# Altium schematic sheet SOM.SchDoc
size A3; SheetNumber: 1; SheetTotal: 1; PageSetup: Record=PageOptions|CenterHorizontal=True|CenterVertical=True|PrintScale=0.97|XCorrection=1.00|YCorrection=1.00|PrintKind=1|BorderSize=5000000|LeftOffset=0|BottomOffset=0|Orientation=2|PaperLength=2970|PaperWidth=2100|Scale=100|PaperSource=7|PrintQuality=600|MediaType=1|DitherType=10|PaperKind=A4|PrintScaleMode=1
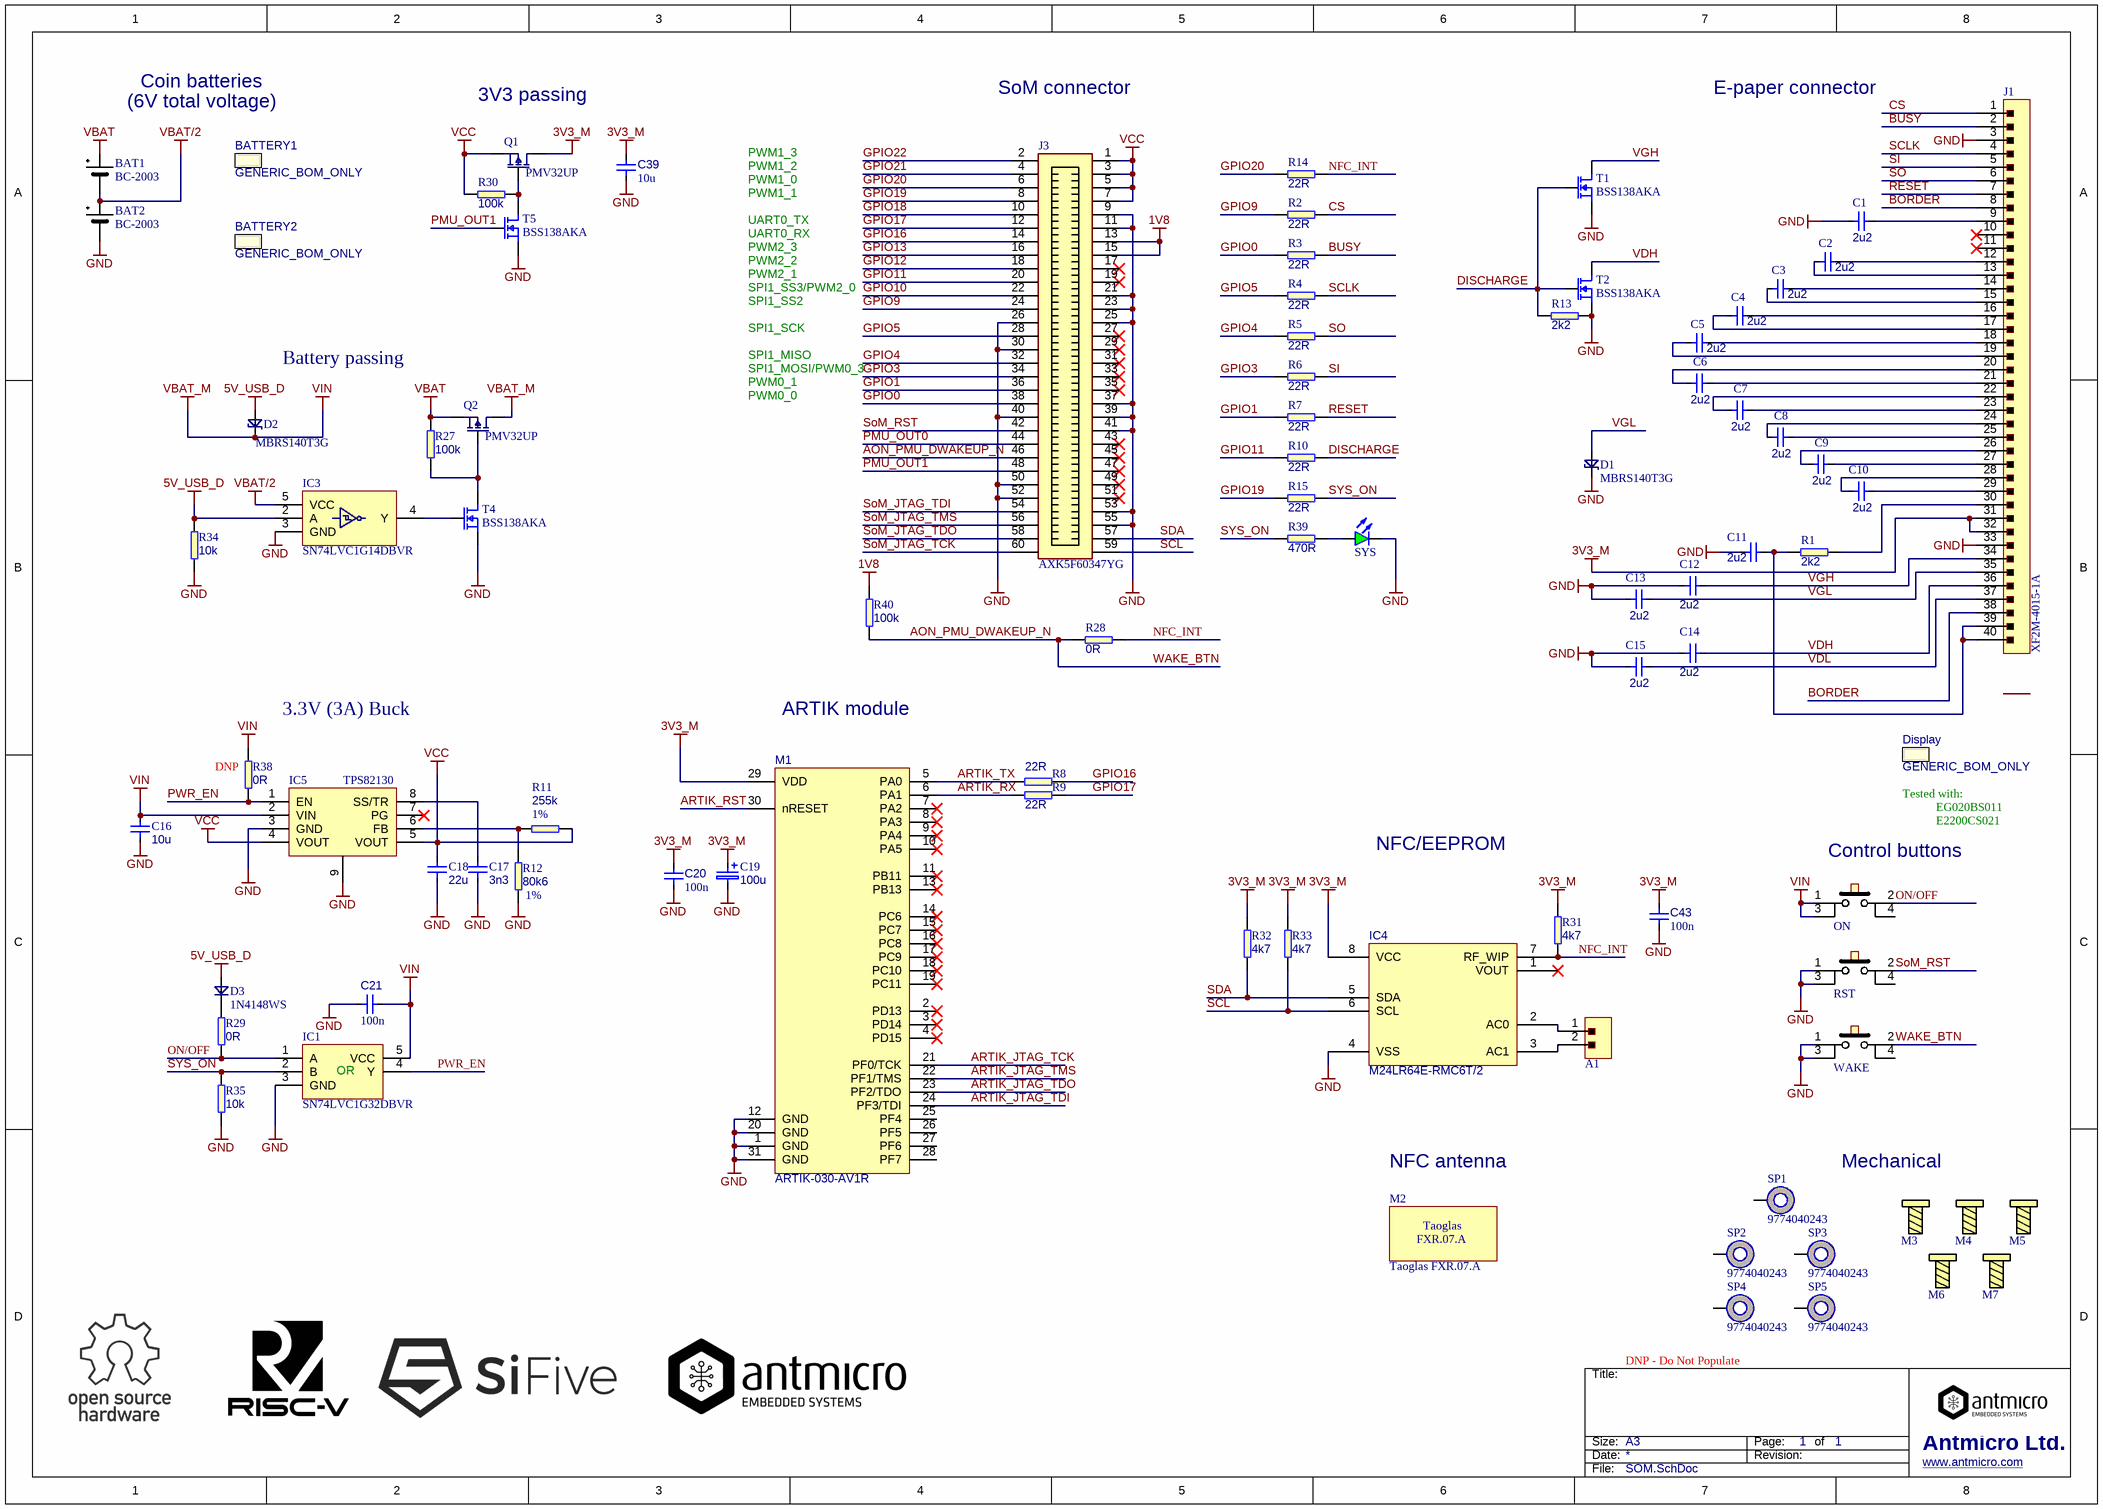
[diagram p0: SOM.SchDoc]

## Parts
A1  811-22-002-30-001101  [812-22-002-30-003101]  (value not drawn)
BAT1  BC-2003  [BC-2003]
BAT2  BC-2003  [BC-2003]
BATTERY1  GENERIC_BOM_ONLY  (mechanical)
BATTERY2  GENERIC_BOM_ONLY  (mechanical)
C1  2u2  [0402]
C2  2u2  [0603]
C3  2u2  [0603]
C4  2u2  [0603]
C5  2u2  [0603]
C6  2u2  [0603]
C7  2u2  [0603]
C8  2u2  [0603]
C9  2u2  [0603]
C10  2u2  [0603]
C11  2u2  [0402]
C12  2u2  [0603]
C13  2u2  [0603]
C14  2u2  [0603]
C15  2u2  [0603]
C16  10u  [0805]
C17  3n3  [0603]
C18  22u  [0805]
C19  100u  [KEMET_A]
C20  100n  [0603]
C21  100n  [0402]
C39  10u  [0402]
C43  100n  [0402]
D1  MBRS140T3G  [SMB]
D2  MBRS140T3G  [SMB]
D3  1N4148WS  [SOD-323]
Display  GENERIC_BOM_ONLY  (mechanical)
IC1  SN74LVC1G32DBVR  [SOT23-5]
IC3  SN74LVC1G14DBVR  [SOT23-5]
IC4  M24LR64E-RMC6T/2  [UFDFPN-8]
IC5  TPS82130  [MicroSIP]
J1  XF2M-4015-1A  [XF2M-4015-1A]
J3  AXK5F60347YG  [AXK5F60347YG]
M1  ARTIK-030-AV1R  [ARTIK-030]
M2  Taoglas FXR.07.A  (mechanical)
M3  M2x5  (value not drawn)  (mechanical)
M4  M2x5  (value not drawn)  (mechanical)
M5  M2x5  (value not drawn)  (mechanical)
M6  M2x5  (value not drawn)  (mechanical)
M7  M2x5  (value not drawn)  (mechanical)
ON  434333045822  [434333045822]  (value not drawn)
Q1  PMV32UP  [SOT-23]
Q2  PMV32UP  [SOT-23]
R1  2k2  [0402]
R2  22R  [0402]
R3  22R  [0402]
R4  22R  [0402]
R5  22R  [0402]
R6  22R  [0402]
R7  22R  [0402]
R8  22R  [0603]
R9  22R  [0603]
R10  22R  [0402]
R11  Tolerance: 1%  [0402]  (hidden comment: 255k)
R12  Tolerance: 1%  [0402]  (hidden comment: 80k6)
R13  2k2  [0402]
R14  22R  [0402]
R15  22R  [0402]
R27  100k  [0402]
R28  0R  [0402]
R29  0R  [0402]
R30  100k  [0402]
R31  4k7  [0402]
R32  4k7  [0402]
R33  4k7  [0402]
R34  10k  [0402]
R35  10k  [0402]
R38  0R  [0402]
R39  470R  [0603]
R40  100k  [0402]
RST  434333045822  [434333045822]  (value not drawn)
SP1  9774040243  [M2-1mm]  (mechanical)
SP2  9774040243  [M2-4mm]  (mechanical)
SP3  9774040243  [M2-4mm]  (mechanical)
SP4  9774040243  [M2-4mm]  (mechanical)
SP5  9774040243  [M2-4mm]  (mechanical)
SYS  KPT-1608SGC  [LED0603]  (value not drawn)
T1  BSS138AKA  [SOT-23]
T2  BSS138AKA  [SOT-23]
T4  BSS138AKA  [SOT-23]
T5  BSS138AKA  [SOT-23]
WAKE  434333045822  [434333045822]  (value not drawn)

## Nets
1V8: J3.13 J3.15 R40.2
3V3_M: C19.1 C20.2 C39.2 C43.1 IC4.8(VCC) J1.31 J1.32 M1.29(VDD) Q1.3(D) R31.2 R32.2 R33.2
5V_USB_D: D2.A D3.A IC3.2(A) R34.2
GND: BAT2.- C1.1 C11.1 C12.1 C13.1 C14.1 C15.1 C16.1 C17.1 C18.1 C19.2 C20.1 C21.1 C39.1 C43.2 D1.C IC1.3(GND) IC3.3(GND) IC4.4(VSS) IC5.3(GND) IC5.9(GND) J1.3 J1.33 J3.9 J3.11 J3.21 J3.23 J3.25 J3.26 J3.30 J3.37 J3.39 J3.40 J3.41 J3.50 J3.52 J3.53 J3.55 M1.1(GND) M1.12(GND) M1.20(GND) M1.31(GND) R12.2 R13.2 R34.1 R35.1 RST.1 RST.3 SYS.K T1.2(S) T2.2(S) T4.2(S) T5.2(S) WAKE.1 WAKE.3
VBAT: BAT1.+ Q2.2(S) R27.2
VBAT/2: BAT1.- BAT2.+ IC3.5(VCC)
VBAT_M: C16.2 C21.2 D2.C IC1.5(VCC) IC5.2(VIN) ON.1 ON.3 Q2.3(D) R38.2  [also labelled VIN]
VCC: C18.2 IC5.4(VOUT) IC5.5(VOUT) J3.1 J3.3 J3.5 J3.7 Q1.2(S) R11.2 R30.1
AON_PMU_DWAKEUP_N: J3.46 R28.1 R40.1 WAKE.2  [also labelled WAKE_BTN]
ARTIK_JTAG_TCK: M1.21(PF0/TCK)
ARTIK_JTAG_TDI: M1.24(PF3/TDI)
ARTIK_JTAG_TDO: M1.23(PF2/TDO)
ARTIK_JTAG_TMS: M1.22(PF1/TMS)
ARTIK_RST: M1.30(nRESET)
ARTIK_RX: M1.6(PA1) R9.1
ARTIK_TX: M1.5(PA0) R8.1
BORDER: J1.8 J1.38
BUSY: J1.2 R3.2
CS: J1.1 R2.2
DISCHARGE: R10.2 R13.1 T1.1(G) T2.1(G)
GPIO0: J3.38 R3.1
GPIO1: J3.36 R7.1
GPIO3: J3.34 R6.1
GPIO4: J3.32 R5.1
GPIO5: J3.28 R4.1
GPIO9: J3.24 R2.1
GPIO10: J3.22
GPIO11: J3.20 R10.1
GPIO12: J3.18
GPIO13: J3.16
GPIO16: J3.14 R8.2
GPIO17: J3.12 R9.2
GPIO18: J3.10
GPIO19: J3.8 R15.1
GPIO20: J3.6 R14.1
GPIO21: J3.4
GPIO22: J3.2
NFC_INT: IC4.7(RF_WIP) R14.2 R28.2 R31.1
ON/OFF: IC1.1(A) ON.2 R29.1
PMU_OUT0: J3.44
PMU_OUT1: J3.48 T5.1(G)
PWR_EN: IC1.4(Y) IC5.1(EN) R38.1
RESET: J1.7 R7.2
SCL: IC4.6(SCL) J3.59 R33.1
SCLK: J1.4 R4.2
SDA: IC4.5(SDA) J3.57 R32.1
SI: J1.5 R6.2
SO: J1.6 R5.2
SoM_JTAG_TCK: J3.60
SoM_JTAG_TDI: J3.54
SoM_JTAG_TDO: J3.58
SoM_JTAG_TMS: J3.56
SoM_RST: J3.42 RST.2
SYS_ON: IC1.2(B) R15.2 R35.2 R39.2
VDH: C14.2 J1.36 T2.3(D)
VDL: C15.2 J1.37
VGH: C12.2 J1.34 T1.3(D)
VGL: C13.2 D1.A J1.35
NetA1_1: A1.1 IC4.2(AC0)
NetA1_2: A1.2 IC4.3(AC1)
NetC1_2: C1.2 J1.9
NetC2_1: C2.1 J1.13
NetC2_2: C2.2 J1.12
NetC3_1: C3.1 J1.15
NetC3_2: C3.2 J1.14
NetC4_1: C4.1 J1.17
NetC4_2: C4.2 J1.16
NetC5_1: C5.1 J1.19
NetC5_2: C5.2 J1.18
NetC6_1: C6.1 J1.20
NetC6_2: C6.2 J1.21
NetC7_1: C7.1 J1.22
NetC7_2: C7.2 J1.23
NetC8_1: C8.1 J1.24
NetC8_2: C8.2 J1.25
NetC9_1: C9.1 J1.26
NetC9_2: C9.2 J1.27
NetC10_1: C10.1 J1.28
NetC10_2: C10.2 J1.29
NetC11_2: C11.2 J1.39 J1.40 R1.1
NetC17_2: C17.2 IC5.8(SS/TR)
NetD3_C: D3.C R29.2
NetIC3_4: IC3.4(Y) T4.1(G)
NetIC5_6: IC5.6(FB) R11.1 R12.1
NetJ1_30: J1.30 R1.2
NetQ1_1: Q1.1(G) R30.2 T5.3(D)
NetQ2_1: Q2.1(G) R27.1 T4.3(D)
NetR39_1: R39.1 SYS.A

Not connected (* = marked no-connect by the designer): IC4 1(VOUT)*; IC5 7(PG)*; J1 10* 11*; J3 17* 19* 27* 29* 31* 33* 35* 43* 45* 47* 49* 51*; M1 2(PD13)* 3(PD14)* 4(PD15)* 7(PA2)* 8(PA3)* 9(PA4)* 10(PA5)* 11(PB11)* 13(PB13)* 14(PC6)* 15(PC7)* 16(PC8)* 17(PC9)* 18(PC10)* 19(PC11)* 25(PF4) 26(PF5) 27(PF6) 28(PF7); ON 4; RST 4; SP1 1; SP2 1; SP3 1; SP4 1; SP5 1; WAKE 4

## Notes on the sheet
- (6V total voltage)
- Coin batteries
- 3V3 passing
- SoM connector
- E-paper connector
- PWM1_0
- PWM1_2
- PWM1_3
- PWM1_1
- UART0_RX
- UART0_TX
- SPI1_SS2
- SPI1_SS3/PWM2_0
- PWM2_1
- PWM2_2
- PWM2_3
- Battery passing
- SPI1_MISO
- SPI1_SCK
- SPI1_MOSI/PWM0_3
- PWM0_0
- PWM0_1
- 3.3V (3A) Buck
- ARTIK module
- (near R38) DNP
- NFC/EEPROM
- (near ON) Control buttons
- (near Display) Tested with:
- (near Display) EG020BS011
- E2200CS021
- (near M2) NFC antenna
- Mechanical
- DNP - Do Not Populate
- Title:
- Size:
- Date:
- A3
- Revision:
- Page:
- of
- Antmicro Ltd.
- File:
- www.antmicro.com
- (in symbol SN74LVC1G32DBVR) OR
- (in symbol taoglas) Taoglas

## Library data of the parts
A1 = 1X02: Headers & Wire Housings 2P SINGLE ROW HDR .177" PIN HEIGHT; Manufacturer: MILL_MAX; Part Number: 811-22-002-30-001101; Value: 811-22-002-30-001101; Part Symbol: 811-22-002-30-001101
BAT1 BAT2 = battery: SMT holder for  CR2032 battery; Manufacturer: Keystone; Part Number: BC-2003; Value: BC-2003; Part Symbol: BC-2003
BATTERY1 BATTERY2 Display = GENERIC_BOM_ONLY: BOM Only; Manufacturer: Pervasive Displays; Value: EG020BS011; Part Number: GENERIC_BOM_ONLY; Part Symbol: EG020BS011
C1 = C_2u2_0402: MLCC SMT Capacitor 2u2 0402; Manufacturer: TDK; Part Symbol: C1005X5R1A225K050BC; Part Number: C_2u2_0402; Value: 2u2
C2-C10 C12-C15 = C_2u2_0603: MLCC SMT Capacitor 2u2 0603; Manufacturer: TDK; Part Symbol: C1608X5R1V225K080AC; Part Number: C_2u2_0603; Value: 2u2
C11 = C_1u_0402: MLCC SMT Capacitor 1u 0402; Part Number: C_2u2_0603; Manufacturer: MURATA; Part Symbol: GRM155R61C105KA12D; Value: 2u2
C16 = C_10u_0805: MLCC SMT Capacitor 10u 0805; Manufacturer: WALSIN; Part Symbol: 0805F106Z100CT; Part Number: C_10u_0805; Value: 10u
C17 = C_3n3_0603: MLCC SMT Capacitor 3n3 0603; Manufacturer: WALSIN; Part Symbol: 0603B332J500CT; Value: 3n3; Part Number: C_3n3_0603
C18 = C_22u_0805: MLCC SMT Capacitor 22u 0805; Manufacturer: MULTICOMP; Part Symbol: MC0805X226M6R3CT; Value: 22u; Part Number: C_22u_0805
C19 = CPol_100u: Tantalum SMT Capacitor 100uF Case KEMET_A; Part Number: C_100u_KEMET_A; Manufacturer: VISHAY; Part Symbol: 298D107X06R3A2T; Value: 100u
C20 = C_100n_0603: MLCC SMT Capacitor 100nF 0603; Manufacturer: WALSIN; Part Symbol: 0603B104K500CT; Part Number: C_100n_0603; Value: 100n
C21 C43 = C_100n_0402: MLCC SMT Capacitor 100nF 0402; Manufacturer: MULTICOMP; Part Symbol: MC0402X104M100CT; Part Number: C_100n_0402; Value: 100n
C39 = C_10u_0402: MLCC SMT Capacitor 10uF 0402; Manufacturer: TDK; Part Symbol: C1005X5R0J106M050BC; Value: 10u; Part Number: C_10u_0402
D1 D2 = Diode Schottky: DIODE, SCHOTTKY, 1A, 40V, DO-214AA; Manufacturer: ON SEMICONDUCTOR; Part Number: MBRS140T3G; Value: MBRS140T3G; Part Symbol: MBRS140T3G
D3 = diode: Diode small signal; Manufacturer: MULTICOMP; Part Number: 1N4148WS; Value: 1N4148WS; Part Symbol: 1N4148WS
IC1 = SN74LVC1G32DBVR: Single 2-Input OR Gate; Manufacturer: TEXAS INSTRUMENTS; Part Number: SN74LVC1G32DBVR; Value: SN74LVC1G32DBVR; Part Symbol: SN74LVC1G32DBVR
IC3 = SN74LVC1G14: Inverter with schmitt trigger.; Manufacturer: TEXAS INSTRUMENTS; Part Number: SN74LVC1G14DBVR; Value: SN74LVC1G14DBVR; Part Symbol: SN74LVC1G14DBVR
IC4 = M24LR04E_R: RFID Transponder IC 13.56MHz ISO 14443, NFC I²C 2.7 V ~ 5.5 V 8-UFDFN Exposed Pad; Manufacturer: STMicroelectronics; Part Number: M24LR64E-RMC6T/2; Value: M24LR64E-RMC6T/2; Part Symbol: M24LR64E-RMC6T/2
IC5 = TPS82130: Voltage Regulators - Switching Regulators 3-A 17V Step-down Converter Module with Integrated Inductor 8-uSiP -40 to 125; Manufacturer: TEXAS INSTRUMENTS; Part Symbol: TPS82130SILR; Part Number: TPS82130; Value: TPS82130
J1 = XF2M-4015-1A: RECEPTACLE, FPC, ZIF, SMT, 0.5MM, 40WAY; Manufacturer: OMRON ELECTRONIC COMPONENTS; Part Symbol: XF2M40151A; Part Number: XF2M-4015-1A; Value: XF2M-4015-1A
J3 = AXK5F60347YG: CONN SCKT BRD/BRD .5MM 60POS SMD; Manufacturer: PANASONIC; Part Number: AXK5F60347YG; Value: AXK5F60347YG; Part Symbol: AXK5F60347YG
M1 = ARTIK-030: Manufacturer: Samsung; Part Number: ARTIK-030; Part Symbol: ARTIK-030-AV1R; Value: ARTIK-030-AV1R
M2 = taoglas: ANT NFC FLEX CIRC 45.5X0.24MM; Manufacturer: TAOGLAS LIMITED; Part Number: taoglas; Value: Taoglas FXR.07.A; Part Symbol: FXR.07.A
M3-M7 = screw: MACHINE SCREW PAN PHILLIPS M2; Part Number: MPMS 002 0005 PH; Manufacturer: B&F Fastener Supply; Value: M2x5; Part Symbol: MPMS 002 0005 PH
ON RST WAKE = WE_434333045822: 3.5x4.7 mm SMD side push, boss design WS-TASU; Manufacturer: WURTH ELEKTRONIK; Part Number: WE_434333045822; Value: 434333045822; Part Symbol: 434333045822
Q1 Q2 = PMOS: P CH, 20V, 4A; Manufacturer: NXP; Part Number: PMV32UP; Value: PMV32UP; Part Symbol: PMV32UP
R1 R13 = R_2k2_0402: RES, 2k2, 0402; Manufacturer: MULTICOMP; Part Symbol: MCWR04X2201FTL; Part Number: R_2k2_0402; Value: 2k2
R2-R7 R10 R14 R15 = R_22R_0402: RES, 22R, 0402; Manufacturer: VISHAY; Part Symbol: CRCW040222R0FKED; Part Number: R_22r_0402; Value: 22R
R8 R9 = R_22R_0603: RES, 22R, 0603; Manufacturer: BOURNS; Part Symbol: CR0603-JW-220GLF; Part Number: R_22R_0603; Value: 22R
R11 = R_255k_0402: RES, 255k 0402; Manufacturer: PANASONIC; Part Symbol: ERJ-2RKF2553X; Value: 255k; Part Number: R_255k_0402
R12 = R_80k6_0402: RES, 80k6, 0402; Manufacturer: PANASONIC; Part Symbol: ERJ2RKF8062X; Value: 80k6; Part Number: R_80k6_0402
R27 R30 R40 = R_100k_0402: RES, 100k 0402; Manufacturer: VISHAY; Part Symbol: CRCW0402100KFKEDHP; Part Number: R_100k_0402; Value: 100k
R28 R29 R38 = R_0R_0402: RES, 0R, 0402; Manufacturer: MULTICOMP; Part Symbol: MCMR04X000 PTL; Part Number: R_0R_0402; Value: 0R
R31-R33 = R_4k7_0402: RES, 4k7, 0402; Manufacturer: PANASONIC; Part Symbol: ERJ2GEJ472X; Part Number: R_4k7_0402; Value: 4k7
R34 R35 = R_10k_0402: RES, 10k, 0402; Manufacturer: MULTICOMP; Part Symbol: MCMR04X1002FTL; Part Number: R_10k_0402; Value: 10k
R39 = R_470R_0603: RES, 470R, 0603; Manufacturer: BOURNS; Part Symbol: CR0603-JW-471GLF; Part Number: R_470R_0603; Value: 470R
SP1 = SPACER_1.5mm: M2x1.5; Part Number: WE_9774040243; Manufacturer: WURTH ELEKTRONIK; Part Symbol: 9774015243R; Value: 9774040243
SP2-SP5 = SPACER_4mm: M2x4; Part Number: WE_9774040243; Manufacturer: WURTH ELEKTRONIK; Part Symbol: 9774040243R; Value: 9774040243
SYS = LED: LED Green 0603 case; Part Number: LED_G; Manufacturer: KINGBRIGHT; Value: KPT-1608SGC; Part Symbol: KPT-1608SGC
T1 T2 T4 T5 = NMOS: MOSFET, N CH, 60V, 0.2A; Part Number: BSS138; Manufacturer: NXP; Value: BSS138AKA; Part Symbol: BSS138AKA